# Altium schematic sheet circuit.SchDoc
size A4; SheetNumber: 1; SheetTotal: 5
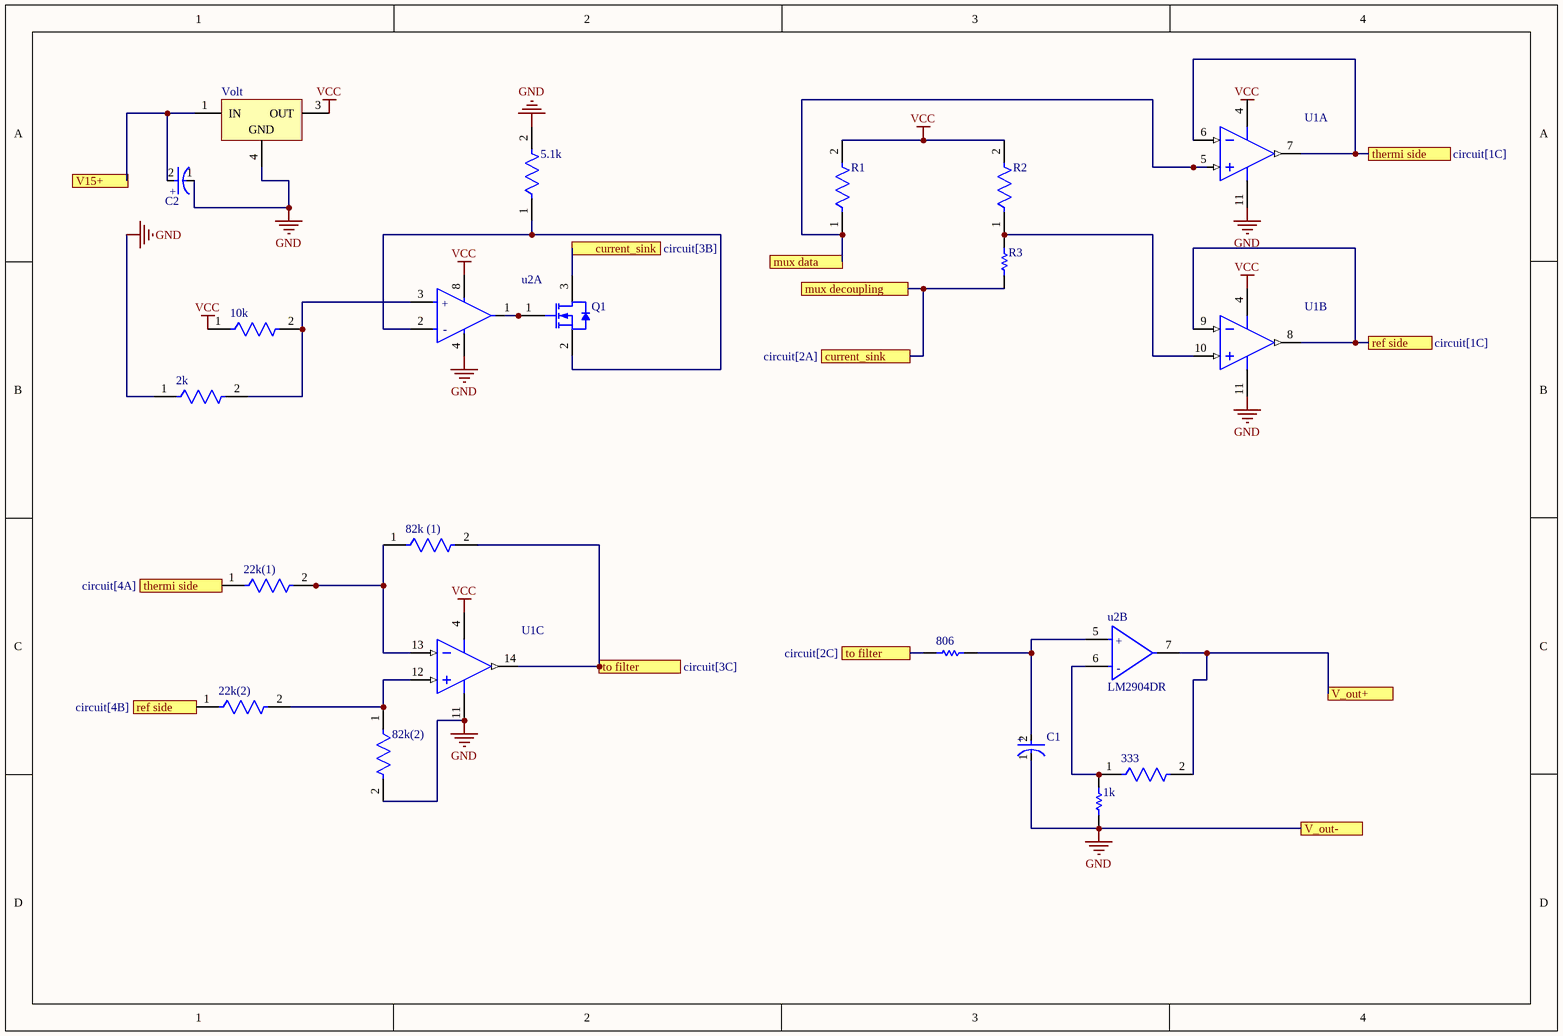
[diagram p0: circuit.SchDoc]

## Parts
1k  CRCW12101K00FKEAHP  [RESC3225X60X45NL20T20]  (value not drawn)
2k  CRCW12062K00FKEA  [FP-CRCW1206-e3-IPC_A]  (value not drawn)
5.1k  CRCW12065K10FKEA  [FP-CRCW1206-e3-IPC_C]  (value not drawn)
10k  CRCW120610K0FKEA  [FP-CRCW1206-e3-IPC_C]  (value not drawn)
22k(1)  CRCW120622K0FKEA  [FP-CRCW1206-e3-IPC_A]  (value not drawn)
22k(2)  CRCW120622K0FKEA  [FP-CRCW1206-e3-IPC_A]  (value not drawn)
82k(2)  CRCW120682K0FKEA  [FP-CRCW1206-e3-IPC_B]  (value not drawn)
82k_(1)  CRCW120682K0FKEA  [FP-CRCW1206-e3-IPC_B]  (value not drawn)
333  CRCW0603330RFKEAHP  [FP-CRCW0603-HPe3-IPC_C]  (value not drawn)
806  RC1206FR-07806RL  [RESC3116X65X40NL10T20]  (value not drawn)
C1  TAJA106K016RNJ  [FP-TAJA-MFG]  (value not drawn)
C2  TAJA106K016RNJ  [FP-TAJA-MFG]  (value not drawn)
Q1  MGSF1N02LT1G  [ONSC-SOT-23-3-318-08_V]  (value not drawn)
R1  CRCW080540K0FKEA  [FP-CRCW0805-e3-MFG]  (value not drawn)
R2  CRCW080540K0FKEA  [FP-CRCW0805-e3-MFG]  (value not drawn)
R3  CRCW120615K0FKEA  [RESC3216X60X45LL10T20]  (value not drawn)
U1  LMH6683MA/NOPB  [D0014A_M]  (value not drawn)  (parts A,B,C of 4)
u2  LM2904DR  [FP-D0008A-MFG]  (value not drawn)  (parts A,B of 2)
Volt  L7812CD2T-TR  [TO-263_M]  (value not drawn)

## Ports
current_sink (see circuit[2A]), current_sink (see circuit[3B]), mux data, mux decoupling, ref side (see circuit[1C]), ref side (see circuit[4B]), thermi side (see circuit[1C]), thermi side (see circuit[4A]), to filter (see circuit[2C]), to filter (see circuit[3C]), V15+, V_out+, V_out-

## Nets
GND: 1k.1 2k.1 5.1k.2 82k(2).2 C1.1(C) C2.1(C) U1.11(V-) u2.4(V-) Volt.4(GND) ; port V_out-
VCC: 10k.1 R1.2 R2.2 U1.4(V+) u2.8(V+) Volt.3(OUT)
current_sink: Q1.3(D) R3.1 ; port current_sink, port mux decoupling
mux data: R1.1 U1.5(IN1+) ; port mux data
ref side: 22k(2).1 U1.8(OUT2) U1.9(IN2-) ; port ref side
thermi side: 22k(1).1 U1.6(IN1-) U1.7(OUT1) ; port thermi side
to filter: 82k_(1).2 806.1 U1.14(OUT3) ; port to filter
V_out+: 333.2 u2.7(OUT2) ; port V_out+
Net1k_2: 1k.2 333.1 u2.6(IN2-)
Net2k_2: 2k.2 10k.2 u2.3(IN1+)
Net5.1k_1: 5.1k.1 Q1.2(S) u2.2(IN1-)
Net22k(1)_2: 22k(1).2 82k_(1).1 U1.13(IN3-)
Net22k(2)_2: 22k(2).2 82k(2).1 U1.12(IN3+)
Net806_2: 806.2 C1.2(A) u2.5(IN2+)
NetC2_2: C2.2(A) Volt.1(IN)
NetQ1_1: Q1.1(G) u2.1(OUT1)
NetR2_1: R2.1 R3.2 U1.10(IN2+)

## Notes on the sheet
- Labels drawn without touching a wire or pin: VCC
- (in symbol CMP-1661-00004-2) +
- (in symbol CMP-04895-000052-2, part A) +; -
- (in symbol CMP-04895-000052-2, part B) +; -

## Library data of the parts
1k = CMP-2005-00195-1: Manufacturer: Vishay Dale; Part Number: CRCW12101K00FKEAHP
2k = CMP-1014-00542-3: RES Thick Film, 2kΩ, 1%, 0.25W, 100ppm/°C, 1206; Max Power Dissipation: 250mW; Voltage Rating: 200V; Resistance: 2kR; Package Quantity: 10; Height: 0.55mm; Tolerance: 1%; Number of Terminations: 2; Mount: Surface Mount; Width: 1.6mm; Length: 3.2mm; Features: Automotive AEC-Q200; Contact Plating: Tin; Number of Pins: 2; Weight: 0.000353oz; Max Operating Temperature: 155°C; Min Operating Temperature: -55°C; Termination: SMD/SMT; Temperature Coefficient: 100ppm/°C; Case Code (Imperial): 1206; Depth: 1.6mm; Military Standard: Not; Case Code (Metric): 3216; Composition: Thick Film; Power Rating: 250mW; Case/Package: 1206; Radiation Hardening: No; Packaging: Tape and Reel
5.1k = CMP-1014-00590-3: RES Thick Film, 5.1kΩ, 1%, 0.25W, 100ppm/°C, 1206; Voltage Rating (DC): 200V; Max Power Dissipation: 250mW; Resistance: 5.1kR; Features: Automotive AEC-Q200; Weight: 0.000353oz; Case Code (Imperial): 1206; Case/Package: 1206; Min Operating Temperature: -55°C; Max Operating Temperature: 155°C; Height: 0.55mm; Termination: SMD/SMT; Case Code (Metric): 3216; Power Rating: 250mW; Lead Free: Lead Free; Contact Plating: Tin; Tolerance: 1%; Depth: 1.6mm; Composition: Thick Film; Radiation Hardening: No; Military Standard: Not; Packaging: Tape and Reel; Width: 1.6mm; Voltage Rating: 200V; Package Quantity: 10; Temperature Coefficient: 100ppm/°C; Length: 3.2mm; Number of Terminations: 2
10k = CMP-2003-04807-2: RES Thick Film, 10kΩ, 1%, 0.25W, 100ppm/°C, 1206; Working Voltage: 200V; Max Power Dissipation: 250mW; Resistance: 10kR; Tolerance: 1%; Width: 0.063inch; Height: 0.55mm; Number of Pins: 2; Voltage Rating: 200V; Temperature Coefficient: 100ppm/°C; Military Standard: Not; Features: Automotive AEC-Q200; Depth: 1.6mm; Radiation Hardening: No; Termination: SMD/SMT; Case Code (Imperial): 1206; Weight: 0.000353oz; Length: 3.2mm; Package Quantity: 10; Voltage Rating (DC): 200V; Case/Package: 1206; Min Operating Temperature: -55°C; Number of Terminations: 2; Composition: Thick Film; Contact Plating: Tin; Power Rating: 250mW; Packaging: Tape and Reel; Max Operating Temperature: 155°C; Lead Free: Lead Free; Case Code (Metric): 3216
22k(1) 22k(2) = CMP-2003-01962-2: RES Thick Film, 22kΩ, 1%, 0.25W, 100ppm/°C, 1206; Voltage Rating (DC): 200V; Resistance: 22kR; Max Power Dissipation: 250mW; Lead Free: Lead Free; Length: 3.2mm; Case Code (Imperial): 1206; Max Operating Temperature: 155°C; Packaging: Tape and Reel; Composition: Thick Film; Temperature Coefficient: 100ppm/°C; Contact Plating: Tin; Number of Terminations: 2; Case Code (Metric): 3216; Tolerance: 1%; Weight: 0.000353oz; Features: Automotive AEC-Q200; Min Operating Temperature: -55°C; Width: 0.063inch; Package Quantity: 10; Case/Package: 1206; Termination: SMD/SMT; Military Standard: Not; Depth: 1.6mm; Voltage Rating: 200V; Radiation Hardening: No; Power Rating: 250mW; Height: 0.55mm
82k(2) 82k_(1) = CMP-2003-02402-2: RES Thick Film, 82kΩ, 1%, 0.25W, 100ppm/°C, 1206; Max Power Dissipation: 250mW; Working Voltage: 200V; Resistance: 82kR; Temperature Coefficient: 100ppm/°C; Max Operating Temperature: 155°C; Depth: 1.6mm; Military Standard: Not; Case/Package: 1206; Number of Terminations: 2; Number of Pins: 2; Power Rating: 250mW; Packaging: Tape and Reel; Package Quantity: 10; Width: 0.063inch; Case Code (Imperial): 1206; Height: 0.55mm; Min Operating Temperature: -55°C; Termination: SMD/SMT; Tolerance: 1%; Voltage Rating (DC): 200V; Weight: 0.000353oz; Composition: Thick Film; Case Code (Metric): 3216; Contact Plating: Tin; Radiation Hardening: No; Lead Free: Lead Free; Voltage Rating: 200V; Features: Automotive AEC-Q200; Length: 3.2mm
333 = CMP-02407-011024-1: RES Thick Film, 330Ω, 1%, 0.33W, 100ppm/°C, 0603; Voltage Rating (DC): 75V; Resistance: 330R; Max Power Dissipation: 250mW; Length: 1.6mm; Case/Package: 0603; Depth: 0.85mm; Contact Plating: Tin; Resistor Type: Thick Film; Number of Terminations: 2; Height: 0.45mm; Radiation Hardening: No; Case Code (Imperial): 0603; Width: 0.033inch; Packaging: Tape and Reel; Weight: 7.1E-05oz; Lead Free: Lead Free; Technology: THICK FILM; Features: Automotive AEC-Q200; Resistance Tolerance: 1%; Tolerance: 1%; Termination: SMD/SMT; Max Operating Temperature: 155°C; RoHS Compliant: Yes; Mount: Surface Mount; Power Rating: 250mW; Series: CRCW-HP; Military Standard: Not; Voltage Rating: 75V; Package Quantity: 1; Temperature Coefficient: 100ppm/°C; Construction: Rectangular; Case Code (Metric): 1608; Min Operating Temperature: -55°C
806 = CMP-2003-03876-1: Manufacturer: Yageo; Part Number: RC1206FR-07806RL
C1 C2 = CMP-1661-00004-2: 10uF 16V  ±10% 3Ω 1206  SMD Tantalum Capacitor; ESR (Equivalent Series Resistance): 3R; Leakage Current: 1.6uA; Dissipation Factor: 8%; Polarity: Polar; Length: 3.2mm; Features: General Purpose; Voltage Rating: 16V; Voltage: 16V; Mount: Surface Mount; Case/Package: 1206; Number of Pins: 2; Case Code (Metric): 3216; Radiation Hardening: No; Min Operating Temperature: -55°C; Case Code (Imperial): 1206; Height - Seated (Max): 0.071inch; Lead Free: Lead Free; Termination: SMD/SMT; Dielectric Material: Tantalum; Width: 1.6mm; Tolerance: 10%; Capacitance: 10uF; Lead Pitch: 1.1mm; Max Operating Temperature: 125°C; Voltage Rating (DC): 16V; Packaging: Tape and Reel; Package Quantity: 1; REACH SVHC: No SVHC; Depth: 1.6mm; Height: 1.6mm
Q1 = CMP-1058-00777-1: Power MOSFET, 750 mA, 20 V, N-Channel, 3-Pin SOT-23, Pb-Free, Tape and Reel; Manufacturer: On Semiconductor; Crss Typ (pF): 45; Ciss Typ (pF): 125; VGS(th) Max (V): 2.4; Coss Typ (pF): 120; PD Max (W): 0.4; VGS Max (V): 20; Configuration: Single; Channel Polarity: N Channel; ID Max (A): 0.75; PackageReference: SOT-23-3-318-08; ComponentLink2Description: Datasheet; PackageVersion: Rev. AP, 11/2009; ComponentLink1URL: http://www.onsemi.com/; RoHS: Pb-Free; Mounting Technology: Surface Mount; Package Type: SOT-23-3; ComponentLink1Description: Manufacturer URL; V(BR)DSS Min (V): 20; PackageDescription: 3-Pin Small Outline Transistor, Body 2.92 x 1.3 mm, Pitch 0.95 mm; Packing: Tape and Reel; PartNumber: MGSF1N02LT1G; DatasheetVersion: Rev. 6; ComponentLink2URL: http://www.onsemi.cn/pub_link/Collateral/MGSF1N02LT1-D.PDF; ComponentLink3URL: http://www.onsemi.cn/pub_link/Collateral/318-08.PDF; ComponentLink3Description: Package Specification
R1 R2 = CMP-02407-003498-1: RES Thick Film, 40kΩ, 1%, 0.125W, 100ppm/°C, 0805; Resistance: 40kR; Max Power Dissipation: 125mW; Tolerance: 1%; Features: Automotive AEC-Q200; Max Operating Temperature: 155°C; Composition: Thick Film; Length: 0.079inch; Case/Package: 0805; Min Operating Temperature: -55°C; Packaging: Tape and Reel; Number of Terminations: 2; Width: 0.049inch; Height: 0.02inch; Package Quantity: 5000; Lead Free: Lead Free; Temperature Coefficient: 100ppm/°C
R3 = CMP-2003-01817-1: Manufacturer: Vishay Dale; Part Number: CRCW120615K0FKEA
U1 = CMP-0055-00500-3: 190MHz Single Supply, Dual and Triple Operational Amplifiers, 14-pin Narrow SOIC, Pb-Free; Manufacturer: Texas Instruments; PowerWise: N; PackageTopMarking: NSUZXYTTE#*LMH66*83MA; ComponentLink1Description: Datasheet URL; Package Reference: D0014A; PackageDescription: Molded Package S.O., .150in Wide, 14 Lead; CompType: Amplifiers; Code_JEDEC: MS-012AB; RoHS: Y; Code_IPC: SOIC127P600-14; ComponentLink1URL: http://www.ti.com/general/docs/lit/getliterature.tsp?genericPartNumber=LMH6683&fileType=pdf; PinCount: 14
u2 = CMP-04895-000052-2: IC OPAMP GP 2 CIRCUIT 8SOIC; Manufacturer: Texas Instruments; Max Supply Voltage: 26V; Nominal Supply Current: 350-500uA; Number Of Channels: 2; Input Offset Voltage: 3mV; Max Dual Supply Voltage: 13V; Max Junction Temp: +150°C; Voltage Gain: 100V/mV; Standoff Height: 0.11mm; Output Current Per Channel: 20mA; Gain Bandwidth: 0.7MHz; Min Dual Supply Voltage: 1.5V; Input Bias Current: -0.02uA; Min Supply Voltage: 3V; RoHS: TRUE; ComponentLink2URL: https://www.ti.com/lit/ds/symlink/lm2904.pdf; Category: IC; Ambient Temperature Range High: +125°C; Digikey Description: IC OPAMP GP 2 CIRCUIT 8SOIC; Automotive: No; Temperature Range High: +125°C; ComponentLink2Description: Datasheet; Mouser Description: Operational Amplifiers - Op Amps Dual GP Op Amp; Lead Free: Yes; Temperature: -40°C to +125°C; Manufacturer Part Number: LM2904DR; Device Class L3: Amplifiers - Op Amps; Device Class L2: Linear ICs; Device Class L1: Integrated Circuits (ICs); Package: D0008A; Octopart: https://octopart.com/lm2904dr-texas+instruments-409181; Height: 1.75mm; Ambient Temperature Range Low: -40°C; Temperature Range Low: -40°C
Volt = CMP-0244-00182-1: Positive Voltage Regulator, 3-Pin D2PAK, Tape and Reel; PackageDescription: 3-Pin Transistor Outline Package 2.54 mm Pitch, 15.4 mm Lead Span (D2PAK); ComponentLink1Description: Manufacturer URL; PackageReference: TO-263; DatasheetVersion: 16/11/2011; ComponentLink2URL: http://www.st.com/internet/com/TECHNICAL_RESOURCES/TECHNICAL_LITERATURE/DATASHEET/CD00000444.pdf; ComponentLink1URL: http://www.st.com; PackageVersion: 2011; ComponentLink2Description: Datasheet